# Altium schematic sheet Mini_V1.0.SchDoc
size A4
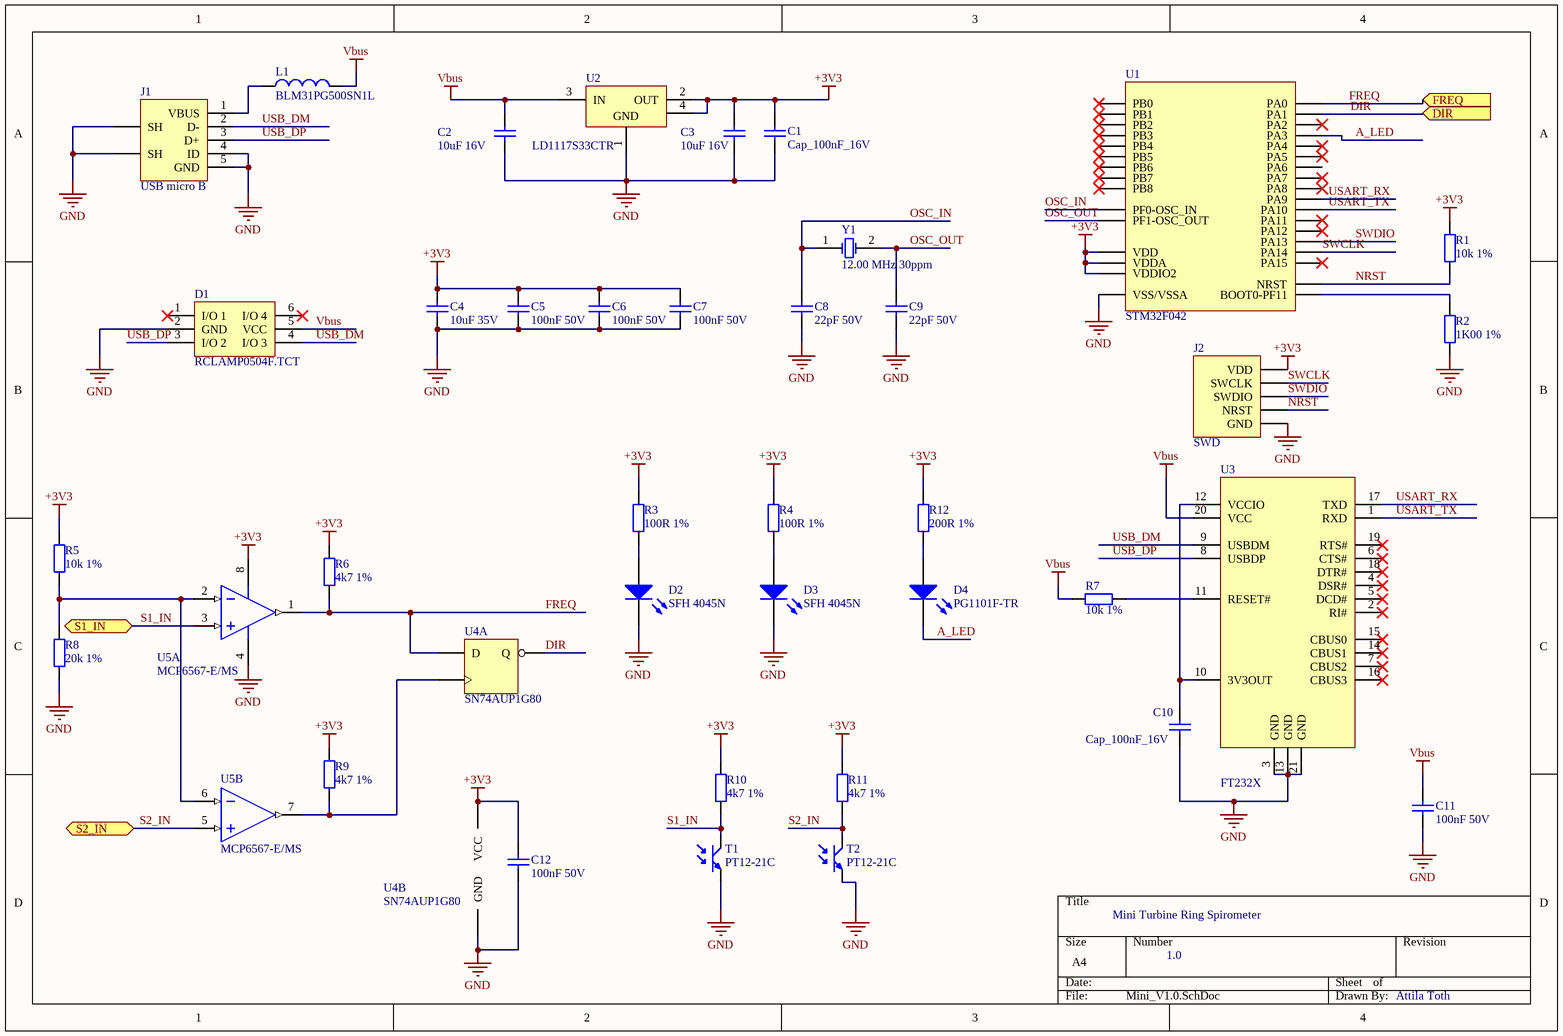
[diagram p0: Mini_V1.0.SchDoc]

## Parts
C1  Cap_100nF_16V  [0603_CAP]
C2  value 10uF 16V  [1206_CAP]  (hidden comment: Cap_10uF_16V)
C3  value 10uF 16V  [1206_CAP]  (hidden comment: Cap_10uF_16V)
C4  10uF 35V  [1206_CAP]
C5  100nF 50V  [0603_CAP]
C6  100nF 50V  [0603_CAP]
C7  100nF 50V  [0603_CAP]
C8  22pF 50V  [0603_CAP]
C9  22pF 50V  [0603_CAP]
C10  Cap_100nF_16V  [0603_CAP]
C11  100nF 50V  [0603_CAP]
C12  100nF 50V  [0603_CAP]
D1  RCLAMP0504F.TCT  [SC70-6]
D2  SFH 4045N  [1506_LED_ANGLE]
D3  SFH 4045N  [1506_LED_ANGLE]
D4  PG1101F-TR  [PG1101F]
J1  value USB micro B  [USB MICRO-B TOP_SM_MOLEX_47346-0001]  (hidden comment: USB Micro B_SM_473461001)
J2  SWD  [HDR1X5]
L1  BLM31PG500SN1L  [1206_IND]
R1  10k 1%  [0603_Res]
R2  1K00 1%  [0603_Res]
R3  100R 1%  [0603_Res]
R4  100R 1%  [0603_Res]
R5  10k 1%  [0603_Res]
R6  4k7 1%  [0603_Res]
R7  10k 1%  [0603_Res]
R8  20k 1%  [0603_Res]
R9  4k7 1%  [0603_Res]
R10  4k7 1%  [0603_Res]
R11  4k7 1%  [0603_Res]
R12  200R 1%  [0603_Res]
T1  PT12-21C  [PTran_side]
T2  PT12-21C  [PTran_side]
U1  STM32F042  [QFN65P700X700X100_HS-33N]
U2  value LD1117S33CTR  [SOT-223]  (hidden comment: LD1117S33CTR-3.3V)
U3  value FT232X  [QFN50P400X400X80_HS-21N]  (hidden comment: FT231X)
U4  SN74AUP1G80  [SOT23-5]  (parts A,B of 2)
U5  MCP6567-E/MS  [MSOP8]  (parts A,B of 2)
Y1  value 12.00 MHz 30ppm  [NXK-32]  (hidden comment: XTAL_12MHz)

## Ports
DIR (in), FREQ (in), S1_IN, S2_IN

## Nets
+3V3: C1.1 C3.1 C4.2 C5.2 C6.2 C7.2 C12.2 J2.1(VDD) R1.2 R3.2 R4.2 R5.2 R6.2 R9.2 R10.2 R11.2 R12.2 U1.1(VDD) U1.5(VDDA) U1.17(VDDIO2) U2.2(OUT) U2.4(GND) U4.5(VCC) U5.8(VDD)
GND: C1.2 C2.2 C3.2 C4.1 C5.1 C6.1 C7.1 C8.1 C9.1 C10.2 C11.1 C12.1 D1.2(GND) D2.1(K) D3.1(K) J1.0(SH) J1.4(ID) J1.5(GND) J2.3(GND) R2.1 R8.1 T1.2(E) T2.2(E) U1.33(VSS/VSSA) U2.1(GND) U3.3(GND) U3.13(GND) U3.21(GND) U4.3(GND) U5.4(VSS)
Vbus: C2.1 C11.2 D1.5(VCC) L1.2 R7.1 U2.3(IN) U3.20(VCC)
A_LED: D4.1(K) U1.9(PA3)
DIR: U1.7(PA1) U4.4(Q) ; port DIR
FREQ: R6.1 U1.6(PA0) U4.1(D) U5.1(VOUTA) ; port FREQ
NRST: J2.5(NRST) R1.1 U1.4(NRST)
OSC_IN: C8.2 U1.2(PF0-OSC_IN) Y1.1(OSC1)
OSC_OUT: C9.2 U1.3(PF1-OSC_OUT) Y1.2(OSC2)
S1_IN: R10.1 T1.1(C) U5.3(VINA+) ; port S1_IN
S2_IN: R11.1 T2.1(C) U5.5(VINB+) ; port S2_IN
SWCLK: J2.2(SWCLK) U1.24(PA14)
SWDIO: J2.4(SWDIO) U1.23(PA13)
USART_RX: U1.19(PA9) U3.17(TXD)
USART_TX: U1.20(PA10) U3.1(RXD)
USB_DM: D1.4(I/O_3) J1.2(D-) U3.9(USBDM)
USB_DP: D1.3(I/O_2) J1.3(D+) U3.8(USBDP)
NetC10_1: C10.1 U3.10(3V3OUT) U3.12(VCCIO)
NetD2_2: D2.2(A) R3.1
NetD3_2: D3.2(A) R4.1
NetD4_2: D4.2(A) R12.1
NetJ1_1: J1.1(VBUS) L1.1
NetR2_2: R2.2 U1.31(BOOT0-PF11)
NetR5_1: R5.1 R8.2 U5.2(VINA-) U5.6(VINB-)
NetR7_2: R7.2 U3.11(RESET#)
NetR9_1: R9.1 U4.2(CLK) U5.7(VOUTB)

Not connected (* = marked no-connect by the designer): D1 1(I/O_1)* 6(I/O_4)*; U1 8(PA2)* 10(PA4)* 11(PA5)* 12(PA6) 13(PA7)* 14(PB0)* 15(PB1)* 16(PB2)* 18(PA8)* 21(PA11)* 22(PA12)* 25(PA15)* 26(PB3)* 27(PB4)* 28(PB5)* 29(PB6)* 30(PB7)* 32(PB8)*; U3 2(RI#)* 4(DSR#)* 5(DCD#)* 6(CTS#)* 7(CBUS2)* 14(CBUS1)* 15(CBUS0)* 16(CBUS3)* 18(DTR#)* 19(RTS#)*

## Notes on the sheet
- Mini Turbine Ring Spirometer
- 1.0
- Attila Toth

## Library data of the parts
C1 C10 = Cap_100nF_16V: 100nF 0603 10% 16V X7R CC0603KPX7R7BB104 (YAG) [82-04-85]; Distributor: Lomex; Order ID: 82-04-85; Price: 0.37; Value: 100nF
C2 C3 = Cap_10uF_16V: 10uF 1206 10% 16V X7R CL31B106KOHNNNE (SAM) [82-08-01]; Distributor: Lomex; Order ID: 82-08-01; Price: 7
C4 = Cap_10uF: CAP CER 10UF 35V Y5V 1206; Order ID:: 587-1352-2-ND; Distributor:: Digikey; Price:: 11.385; Value: 10uF
C5-C7 C11 C12 = Cap_100nF: 100nF 0603 10% 50V X7R CC0603KRX7R9BB104 (YAG) [82-06-23]; Order ID:: 82-06-23; Distributor:: Lomex; Price:: 0.37; Value: 100nF
C8 C9 = Cap_22pF: 22pF 0603 5% 50V NP0 CC0603JRNPO9BN220 (YAG) [82-02-18]; Order ID:: 82-02-18; Distributor:: Lomex; Price:: 0.60; Value: 22pF
D1 = RCLAMP0504F.TCT: SEMTECH - RCLAMP0504F.TCT - DIODE, TVS, 5V; Order ID: RCLAMP0504FCT-ND; Distributor: Digikey; Price: 180; Value: RCLAMP0504F.TCT
D2 D3 = SFH_4045: SFH 4045N High Power Infrared Emitter (940 nm)
D4 = PG1101F-TR: LED GREEN CLEAR 1208 R/A SMD; Manufacturer: Stanley Electric Co; Lens Color: Colorless; Millicandela Rating: 5.2mcd; Lens Style/Size: Rectangle with Domed Top, 2.00mm x 1.00mm; Voltage - Forward (Vf) (Typ): 2.1V; Current - Test: 20mA; Viewing Angle: 149°, 130°; Wavelength - Dominant: 567nm; Wavelength - Peak: 560nm; Order Code: 404-1067-1-ND; Supplier 1: Digi-Key; Manufacturer Part Number: PG1101F-TR; RoHS: RoHS Compliant; Category: Optoelectronics; Stock 1: 11018; Pricing 1: 1=0.54, 10=0.383, 25=0.3148, 100=0.2517, 250=0.18876, 1000=0.13728 (USD); Packaging: Cut Tape (CT); Color: Green; Lens Transparency: Clear; Mounting Type: Surface Mount, Right Angle; Features: -; Package / Case: 2-SMD, No Lead; Supplier Device Package: 2-SMD; Size / Dimension: 3.00mm L x 2.00mm W; Height (Max): 1.00mm; ComponentLink1URL: http://media.digikey.com/pdf/Data%20Sheets/Stanley%20Electric%20PDFs/1101F_Series.pdf; ComponentLink1Description: http://media.digikey.com/pdf/Data%20Sheets/Stanley%20Electric%20PDFs/1101F_Series.pdf
J1 = USB Micro B_SM_473461001: MOLEX - 548190519 - MINI USB TYPE B, RECEPTACLE, THT; Order ID: 538-47346-1001; Distributor: Mouser; Price: 260
J2 = SWD: STM SWD PROGRAMMER CONNECTOR
L1 = Fer_50R@100MHz: FERRITE CHIP 50 OHM 3500MA 1206; Order ID: 490-1055-1-ND; Distributor: Digikey; Price: 40; Value: BLM31PG500SN1L
R1 R5 R7 = Res_10k: 10K0 0603 1% CR-03FL7---10K 0.1W (VIK) [80-11-68]; Distributor: Lomex; Order ID: 80-11-68; Price: 0.24; Value: 10k
R2 = Res_1k: 1K00 0603 1% RC0603FR-13 1K00 0.1W (YAG) [80-15-07]; Order ID: 80-15-07; Distributor: Lomex; Price: 0.22; Value: 1K00
R3 R4 = Res_100R: 100R 0603 1% CR-03FL7--100R 0.1W (VIK) [80-11-53]; Order ID: 80-11-53; Distributor: Lomex; Price: 0.24; Value: 100R
R6 R9-R11 = Res_4k7: 4K70 0603 1% CR-03FL7---4K7 0.1W (VIK) [80-11-85]; Distributor: Lomex; Order ID: 80-11-85; Price: 0.24; Value: 4k7
R8 = Res_20k_1%: 20K0 0603 1% CR-03FL7---20K 0.1W (VIK) [80-14-52]; Order ID: 80-14-52; Distributor: Lomex; Price: 0.24; Value: 20k
R12 = Res_200R_1%: 200R 0603 1% CR-03FL7--200R 0.1W (VIK) [80-14-37]; Order ID: 80-14-37; Distributor: Lomex; Price: 0.24; Value: 200R
T1 T2 = PT12-21C/TR8: PHOTOTRANSISTOR WATER CLR RA SMD; Manufacturer: Everlight Electronics Co Ltd; Voltage - Collector Emitter Breakdown (Max): 30V; Current - Collector (Ic) (Max): 50mA; Current - Dark (Id) (Max): 100nA; Wavelength: 940nm; Power - Max: 75mW; Supplier 1: Digi-Key; Manufacturer Part Number: PT12-21C/TR8; RoHS: RoHS Compliant; Category: Sensors, Transducers; Stock 1: 50299; Pricing 1: 1=0.39, 10=0.282, 100=0.1659, 250=0.11736, 500=0.10016, 1000=0.07825 (USD); Viewing Angle: -; Mounting Type: Surface Mount, Right Angle; Orientation: Side View; Package / Case: 2-SMD, No Lead; ComponentLink1URL: http://www.everlight.com/file/ProductFile/PT12-21C-TR8.pdf; ComponentLink1Description: http://www.everlight.com/file/ProductFile/PT12-21C-TR8.pdf
U1 = STM32F042K6U6: 32 Bit Microcontroller, USB Line, ARM Cortex-M0, 48 MHz, 32 KB, 6 KB, 32, UFQFN; Manufacturer: STMICROELECTRONICS; CPU Speed: 48; Program Memory Size: 32; RAM Memory Size: 6; No. of I/O's: 28; Embedded Interface Type: CAN, I2; Supply Voltage Min: 2; Supply Voltage Max: 3.6; SVHC: No SVHC (15-Jun-2015; Supplier 1: Farnell; Manufacturer Part Number: STM32F042K6U6; RoHS: YES; Stock 1: 468; Pricing 1: 1=826,305, 10=687,182, 100=590,218, 250=556,491, 500=489,037, 1000=415,682 (EUR); Architecture: ARM Cortex-M0; No. of Pins: 32; MCU Case Style: UFQFN; Packaging: Each; MSL: MSL 3 - 168 hours; ComponentLink1URL: http://www.farnell.com/datasheets/1886881.pdf; ComponentLink1Description: http://www.farnell.com/datasheets/1886881.pdf; Supplier Part Number 1: 2469554
U2 = LD1117S33CTR-3.3V: LD1117S33CTR (STM) FIX 3.3V 0.95A LDO.VOLT.REG. SOT-223 -40+150°C [89-06-98]; Distributor: Lomex; Order ID: 89-06-98; Price: 40
U3 = FT231X: FT232RL (FTD) USB UART IC SSOP-28 [89-21-46]; Distributor: Lomex; Order ID: 89-21-46; Price: 872
U4 = SN74AUP1G80DBVR: TEXAS INSTRUMENTS - SN74AUP1G80DBVR - IC, FLIP-FLOP, DTYPE, CMOS, 5TSOP; Flip-Flop Type: D; Propagation Delay: 6.4; Supply Voltage Min: 800; Supply Voltage Max: 3.6; Logic Case Style: SOT-23; No. of Pins: 5; Frequency: 260; Trigger Type: Positive Edge; SVHC: No SVHC (15-Jun-2015; Supplier 1: Farnell; Manufacturer: TEXAS INSTRUMENTS; Manufacturer Part Number: SN74AUP1G80DBVR; RoHS: YES; Stock 1: 2791; Pricing 1: 1=33,938, 10=31,155, 100=28,288, 250=25,927, 500=21,501 (EUR); Output Current: -; IC Output Type: -; Operating Temperature Min: -40; Operating Temperature Max: 85; Packaging: Cut Tape; MSL: -; ComponentLink1URL: http://www.farnell.com/datasheets/1887615.pdf; ComponentLink1Description: http://www.farnell.com/datasheets/1887615.pdf
U5 = MCP6567-E/MS: Analogue Comparator, Dual, Low Power, 2, 34 ns, 1.8V to 5.5V, MSOP, 8; Order ID: 1834862; Price: 216; Distributor: Farnell; Value: MCP6567-E/MS
Y1 = XTAL_12MHz: 12.000000MHz QUARZ HC49/SMD (NSK) ˝30ppm LOW PROFILE SMD [40-01-25]; Distributor: Lomex; Order ID: 40-01-25; Price: 33.96